# Altium schematic sheet conn_ext-module.SchDoc: Conectroes para Módulos Externos
size A4; Engineer: Amós Nunes; SheetNumber: 5; SheetTotal: 5; Tamanho: A4; Equipament: E. T. Wheelchair
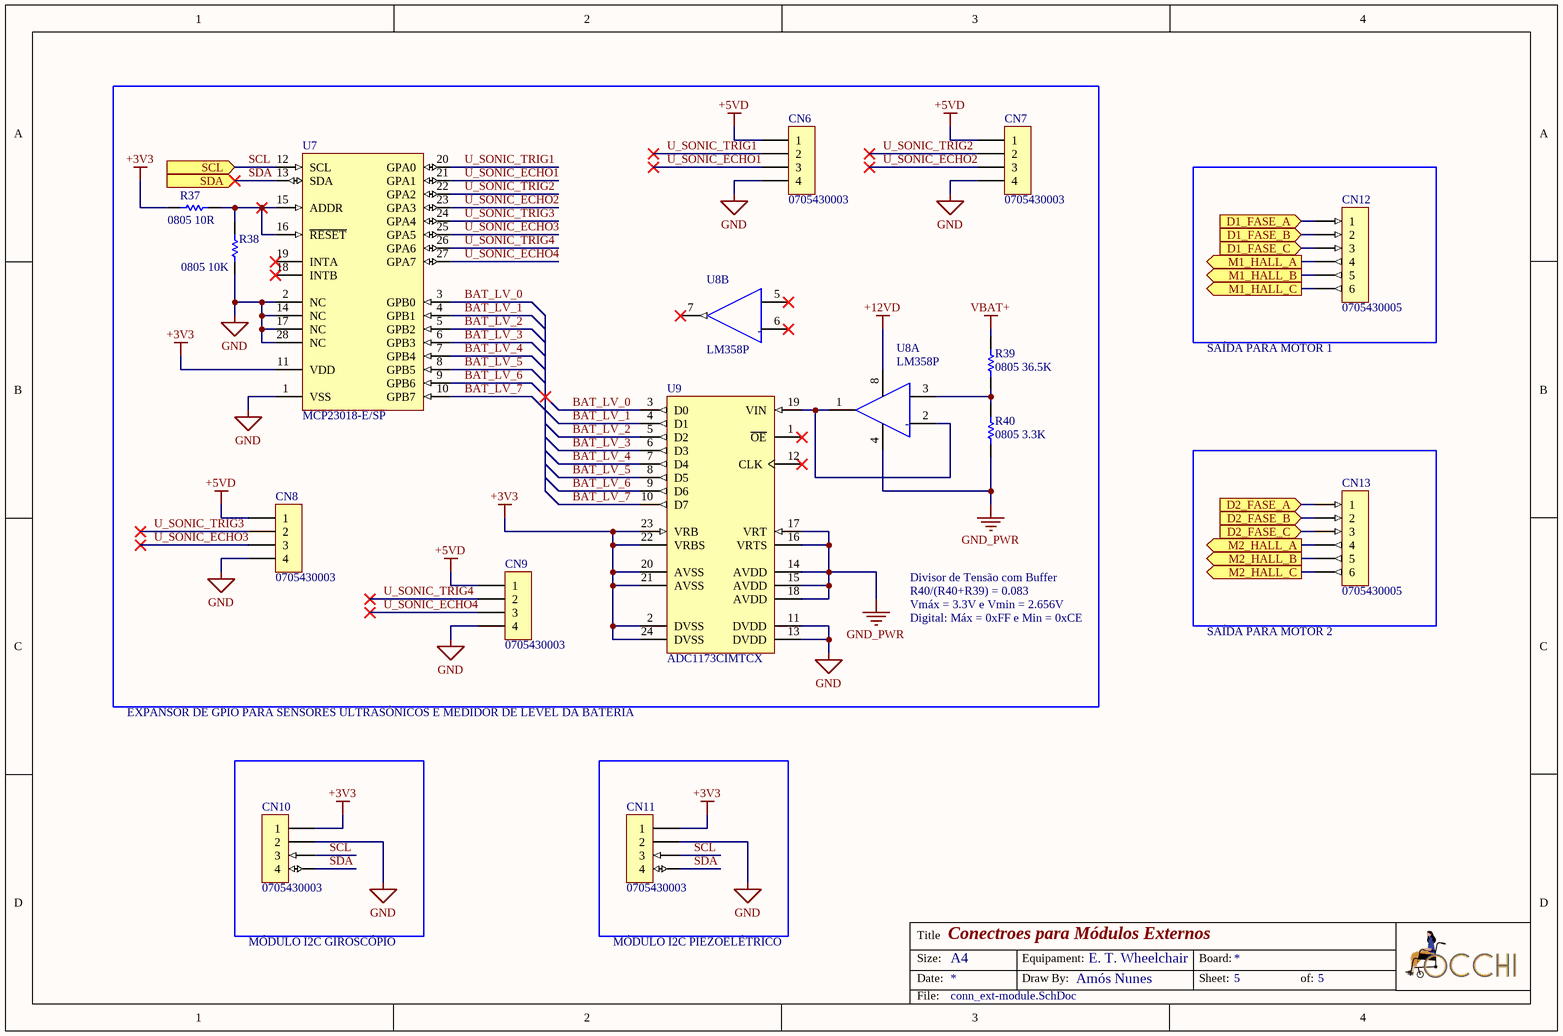
[diagram p0: conn_ext-module.SchDoc]

## Parts
CN6  0705430003  [FP-0705430003-MFG]
CN7  0705430003  [FP-0705430003-MFG]
CN8  0705430003  [FP-0705430003-MFG]
CN9  0705430003  [FP-0705430003-MFG]
CN10  0705430003  [FP-0705430003-MFG]
CN11  0705430003  [FP-0705430003-MFG]
CN12  0705430005  [FP-0705430005-MFG]
CN13  0705430005  [FP-0705430005-MFG]
R37  0805 10R  [CAP0805]
R38  0805 10K  [RES0805]
R39  0805 36.5K  [RES0805]
R40  0805 3.3K  [RES0805]
U7  MCP23018-E/SP  [SPDIP300-SP28]
U8  LM358P  [P0008A]  (parts A,B of 2)
U9  ADC1173CIMTCX  [PW0024A_N]

## Ports
D1_FASE_A (in), D1_FASE_B (in), D1_FASE_C (in), D2_FASE_A (in), D2_FASE_B (in), D2_FASE_C (in), M1_HALL_A (out), M1_HALL_B (out), M1_HALL_C (out), M2_HALL_A (out), M2_HALL_B (out), M2_HALL_C (out), SCL (in), SDA (in)

## Nets
+3V3: CN10.1 CN11.1 R37.1 U7.11(VDD) U9.2(DVSS) U9.20(AVSS) U9.21(AVSS) U9.22(VRBS) U9.23(VRB) U9.24(DVSS)
+5VD: CN6.1 CN7.1 CN8.1 CN9.1
+12VD: U8.8(V+)
GND: CN6.4 CN7.4 CN8.4 CN9.4 CN10.2 CN11.2 R38.2 U7.1(VSS) U7.2(NC) U7.14(NC) U7.17(NC) U7.28(NC) U9.11(DVDD) U9.13(DVDD)
GND_PWR: R40.1 U8.4(V-) U9.14(AVDD) U9.15(AVDD) U9.16(VRTS) U9.17(VRT) U9.18(AVDD)
VBAT+: R39.2
BAT_LV_0: U7.3(GPB0) U9.3(D0)
BAT_LV_1: U7.4(GPB1) U9.4(D1)
BAT_LV_2: U7.5(GPB2) U9.5(D2)
BAT_LV_3: U7.6(GPB3) U9.6(D3)
BAT_LV_4: U7.7(GPB4) U9.7(D4)
BAT_LV_5: U7.8(GPB5) U9.8(D5)
BAT_LV_6: U7.9(GPB6) U9.9(D6)
BAT_LV_7: U7.10(GPB7) U9.10(D7)
D1_FASE_A: CN12.1 ; port D1_FASE_A
D1_FASE_B: CN12.2 ; port D1_FASE_B
D1_FASE_C: CN12.3 ; port D1_FASE_C
D2_FASE_A: CN13.1 ; port D2_FASE_A
D2_FASE_B: CN13.2 ; port D2_FASE_B
D2_FASE_C: CN13.3 ; port D2_FASE_C
M1_HALL_A: CN12.4 ; port M1_HALL_A
M1_HALL_B: CN12.5 ; port M1_HALL_B
M1_HALL_C: CN12.6 ; port M1_HALL_C
M2_HALL_A: CN13.4 ; port M2_HALL_A
M2_HALL_B: CN13.5 ; port M2_HALL_B
M2_HALL_C: CN13.6 ; port M2_HALL_C
SCL: CN10.3 CN11.3 U7.12(SCL) ; port SCL
SDA: CN10.4 CN11.4 U7.13(SDA) ; port SDA
U_SONIC_ECHO1: CN6.3 U7.21(GPA1)
U_SONIC_ECHO2: CN7.3 U7.23(GPA3)
U_SONIC_ECHO3: CN8.3 U7.25(GPA5)
U_SONIC_ECHO4: CN9.3 U7.27(GPA7)
U_SONIC_TRIG1: CN6.2 U7.20(GPA0)
U_SONIC_TRIG2: CN7.2 U7.22(GPA2)
U_SONIC_TRIG3: CN8.2 U7.24(GPA4)
U_SONIC_TRIG4: CN9.2 U7.26(GPA6)
NetR37_2: R37.2 R38.1 U7.15(ADDR) U7.16(~{RESET})
NetR39_1: R39.1 R40.2 U8.3(IN1+)
NetU8_1: U8.1(1OUT) U8.2(IN1-) U9.19(VIN)

Not connected (* = marked no-connect by the designer): U7 18(INTB)* 19(INTA)*; U8 5(IN2+)* 6(IN2-)* 7(2OUT)*; U9 1(~{OE})* 12(CLK)*

## Notes on the sheet
- SAÍDA PARA MOTOR 1
- Divisor de Tensão com Buffer
- R40/(R40+R39) = 0.083
- Vmáx = 3.3V e Vmin = 2.656V
- Digital: Máx = 0xFF e Min = 0xCE
- SAÍDA PARA MOTOR 2
- EXPANSOR DE GPIO PARA SENSORES ULTRASÔNICOS E MEDIDOR DE LEVEL DA BATERIA
- MÓDULO I2C GIROSCÓPIO
- MÓDULO I2C PIEZOELÉTRICO
- Title
- Size:
- Date:
- Equipament:
- Draw By:
- Sheet:
- Board:
- of:
- File:
- (in symbol LM358P, part A) -
- (in symbol LM358P, part B) -

## Library data of the parts
CN6-CN11 = 0705430003: 2.54mm SL Header, Single Row, Vertical, 3.05mm Pocket, Shrouded, 4 Circuits, 0.38µm Gold (Au) Selective Plating, Tin (Sn) PC Tail Plating; Manufacturer: Molex; Contact Resistance: 30mR; Number of Positions: 4; Connector Type: Male Pin; Pitch: 0.1inch; Supplier 1: RSComponents; Manufacturer Part Number: 0705430003; RoHS: Yes; Category: Headers and Wire Housings; Stock 1: 2910; Pricing 1: 10=1,05000, 200=0,90600, 750=0,74800, 3000=0,60400, 6000=0,57300 (USD); Mount: Through Hole; Color: Black; Contact Plating: Gold; Contact Material: Bronze; Housing Color: Black; Housing Material: Polyester; Min Operating Temperature: -40°C; Max Operating Temperature: 105°C; Packaging: Rail/Tube; Number of Rows: 1; Termination: Solder; Orientation: Straight; Series: C-Grid® SL™ 70543; Contact Type: Male Pin; Length: 12.71mm; Depth: 6.6mm; Contact Mating Length: 0.24inch; Radiation Hardening: No; RoHS Compliant: Yes; Supplier Part Number 1: 6792471
CN12 CN13 = 0705430005: Conn Shrouded Header (4 Sides) HDR 6 POS 2.54mm Solder ST Top Entry Thru-Hole SL™ Tube; Manufacturer: Molex; Contact Resistance: 30mR; Number of Positions: 6; Connector Type: Male Pin; Pitch: 0.1inch; Supplier 1: RSComponents; Manufacturer Part Number: 0705430005; RoHS: Yes; Category: Headers and Wire Housings; Stock 1: 440; Pricing 1: 10=1,32100, 200=1,15000, 750=0,92500, 3000=0,75400, 6000=0,73000 (USD); Mount: Through Hole; Contact Plating: Gold; Contact Material: Bronze; Color: Black; Housing Color: Black; Housing Material: Polyester; Min Operating Temperature: -40°C; Max Operating Temperature: 105°C; Packaging: Rail/Tube; Number of Rows: 1; Termination: Solder; Orientation: Straight; Series: C-Grid® SL™ 70543; Contact Type: Male Pin; Length: 17.79mm; Depth: 6.6mm; Contact Mating Length: 0.24inch; Radiation Hardening: No; RoHS Compliant: Yes; ComponentLink1URL: http://components.arrow.com/part/dataview/2934603S3153303N3303?src-supplier=Arrow+Electronics; ComponentLink1Description: http://components.arrow.com/part/dataview/2934603S3153303N3303?src-supplier=Arrow+Electronics; ComponentLink2URL: http://components.arrow.com/part/dataview/0323_00048382?src-supplier=Arrow+Europe; ComponentLink2Description: http://components.arrow.com/part/dataview/0323_00048382?src-supplier=Arrow+Europe; Supplier Part Number 1: 6792483
R37 = RC0805FR-0710RL: 10R Ohms ± 1.00% 0.125W ± 200ppm/℃ 0805; Manufacturer: Yageo; Power Rating: 125mW; Tolerance: 1%; Voltage Rating: 150V; Temperature Coefficient: 200ppm/°C; Supplier 1: RSComponents; Manufacturer Part Number: RC0805FR-0710RL; RoHS: Yes; Category: Chip SMD Resistors; Stock 1: 170000; Pricing 1: 5000=0,01300 (USD); Case/Package: 0805; Number of Pins: 2; Case Code (Imperial): 0805; Case Code (Metric): 2012; Size Code: 0805; Min Operating Temperature: -55°C; Max Operating Temperature: 155°C; Resistance: 10R; Packaging: Tape and Reel; Voltage Rating (DC): 150V; Package Quantity: 1; Termination: SMD/SMT; Resistor Type: Thick Film; Number of Terminations: 2; Max Power Dissipation: 125mW; Features: Moisture Resistant; Series: RC; Resistance Tolerance: 1%; Construction: Rectangular; Technology: THICK FILM; Length: 2mm; Width: 1.25mm; Height: 0.5mm; Depth: 1.25mm; RoHS Compliant: Yes; REACH SVHC: No SVHC; Lead Free: Lead Free; ComponentLink1URL: https://datasheet.ciiva.com/11809/0900766b8106beab-11809370.pdf?src-supplier=RSComponents; ComponentLink1Description: https://datasheet.ciiva.com/11809/0900766b8106beab-11809370.pdf?src-supplier=RSComponents; ComponentLink2URL: https://datasheet.ciiva.com/46412/444164-46412859.pdf?src-supplier=Element14; ComponentLink2Description: https://datasheet.ciiva.com/46412/444164-46412859.pdf?src-supplier=Element14; ComponentLink3URL: https://datasheet.ciiva.com/46447/444164-46447565.pdf?src-supplier=Element14; ComponentLink3Description: https://datasheet.ciiva.com/46447/444164-46447565.pdf?src-supplier=Element14; ComponentLink4URL: https://datasheet.ciiva.com/2457/pyu-r-int-thick-7-2457099.pdf?src-supplier=Digi-Key; ComponentLink4Description: https://datasheet.ciiva.com/2457/pyu-r-int-thick-7-2457099.pdf?src-supplier=Digi-Key; ComponentLink5URL: https://datasheet.ciiva.com/2457/pyu-r-int-thick-7-2457100.pdf?src-supplier=Digi-Key; ComponentLink5Description: https://datasheet.ciiva.com/2457/pyu-r-int-thick-7-2457100.pdf?src-supplier=Digi-Key; ComponentLink6URL: https://datasheet.ciiva.com/2457/pyu-r-int-thick-7-2457098.pdf?src-supplier=Digi-Key; ComponentLink6Description: https://datasheet.ciiva.com/2457/pyu-r-int-thick-7-2457098.pdf?src-supplier=Digi-Key; ComponentLink7URL: https://datasheet.ciiva.com/12555/rc0805-257173-12555112.pdf?src-supplier=Mouser; ComponentLink7Description: https://datasheet.ciiva.com/12555/rc0805-257173-12555112.pdf?src-supplier=Mouser; ComponentLink8URL: https://datasheet.ciiva.com/7941/444164-7941688.pdf?src-supplier=Element14; ComponentLink8Description: https://datasheet.ciiva.com/7941/444164-7941688.pdf?src-supplier=Element14; ComponentLink9URL: https://datasheet.ciiva.com/7941/444164-7941687.pdf?src-supplier=Element14; ComponentLink9Description: https://datasheet.ciiva.com/7941/444164-7941687.pdf?src-supplier=Element14; Supplier Part Number 1: 6185179
R38 = RC0805FR-0710KL: 10K Omhs 0805 ± 1.00% 0.125W ± 100ppm/℃; Manufacturer: Yageo; Manufacturer Part Number: RC0603FR-0710KL; Tolerance: 1%; Resistance: 10kR; Temperature Coefficient: 100ppm/°C; Voltage Rating: 75V; Voltage Rating (DC): 50V; Power Rating: 100mW; RoHS: Yes; Category: Chip SMD Resistors; Stock 1: 19091268; Pricing 1: 5000=0,00312 (USD); Case/Package: 0603; Number of Pins: 2; Case Code (Imperial): 0603; Case Code (Metric): 1608; Weight: 7.1E-05oz; Size Code: 0603; Min Operating Temperature: -55°C; Max Operating Temperature: 155°C; Resistor Type: Thick Film; Packaging: Tape and Reel; Termination: SMD/SMT; Features: Moisture Resistant; Series: RC; Max Power Dissipation: 100mW; Number of Terminations: 2; Resistance Tolerance: 1%; Construction: Rectangular; Length: 1.6mm; Width: 0.8mm; Height: 0.45mm; Depth: 0.8mm; Lead Pitch: 0.3mm; RoHS Compliant: Yes; REACH SVHC: Unknown; Military Standard: Not; Lead Free: Lead Free; ComponentLink1URL: https://datasheet.ciiva.com/7660/38590-7660789.pdf?src-supplier=Element14; ComponentLink1Description: https://datasheet.ciiva.com/7660/38590-7660789.pdf?src-supplier=Element14; ComponentLink2URL: https://datasheet.ciiva.com/7983/443971-7983596.pdf?src-supplier=Element14; ComponentLink2Description: https://datasheet.ciiva.com/7983/443971-7983596.pdf?src-supplier=Element14; ComponentLink3URL: https://datasheet.ciiva.com/22747/443971-22747519.pdf?src-supplier=Element14; ComponentLink3Description: https://datasheet.ciiva.com/22747/443971-22747519.pdf?src-supplier=Element14; ComponentLink4URL: https://datasheet.ciiva.com/46440/1868787-46440891.pdf?src-supplier=Element14; ComponentLink4Description: https://datasheet.ciiva.com/46440/1868787-46440891.pdf?src-supplier=Element14; ComponentLink5URL: https://datasheet.ciiva.com/7746/1738695-7746239.pdf?src-supplier=Element14; ComponentLink5Description: https://datasheet.ciiva.com/7746/1738695-7746239.pdf?src-supplier=Element14; ComponentLink6URL: https://datasheet.ciiva.com/15189/getdatasheetpartid-409289-15189591.pdf?src-supplier=Verical; ComponentLink6Description: https://datasheet.ciiva.com/15189/getdatasheetpartid-409289-15189591.pdf?src-supplier=Verical; Stock 2: 435000; Pricing 2: 5000=0,00700 (USD); Package Quantity: 1; Technology: THICK FILM; ComponentLink7URL: https://datasheet.ciiva.com/11808/0900766b8106beab-11808151.pdf?src-supplier=RSComponents; ComponentLink7Description: https://datasheet.ciiva.com/11808/0900766b8106beab-11808151.pdf?src-supplier=RSComponents; ComponentLink8URL: https://datasheet.ciiva.com/46447/444164-46447563.pdf?src-supplier=Element14; ComponentLink8Description: https://datasheet.ciiva.com/46447/444164-46447563.pdf?src-supplier=Element14; ComponentLink9URL: https://datasheet.ciiva.com/2456/pyu-r-int-thick-7-2456973.pdf?src-supplier=Digi-Key; ComponentLink9Description: https://datasheet.ciiva.com/2456/pyu-r-int-thick-7-2456973.pdf?src-supplier=Digi-Key; ComponentLink10URL: https://datasheet.ciiva.com/2456/pyu-r-int-thick-7-2456974.pdf?src-supplier=Digi-Key; ComponentLink10Description: https://datasheet.ciiva.com/2456/pyu-r-int-thick-7-2456974.pdf?src-supplier=Digi-Key; ComponentLink11URL: https://datasheet.ciiva.com/2456/pyu-r-int-thick-7-2456972.pdf?src-supplier=Digi-Key; ComponentLink11Description: https://datasheet.ciiva.com/2456/pyu-r-int-thick-7-2456972.pdf?src-supplier=Digi-Key; ComponentLink12URL: https://datasheet.ciiva.com/12669/rc0805-12669688.pdf?src-supplier=Mouser; ComponentLink12Description: https://datasheet.ciiva.com/12669/rc0805-12669688.pdf?src-supplier=Mouser; ComponentLink13URL: https://datasheet.ciiva.com/16747/rc0805-16747087.pdf?src-supplier=Future+Electronics; ComponentLink13Description: https://datasheet.ciiva.com/16747/rc0805-16747087.pdf?src-supplier=Future+Electronics; Supplier 1: RSComponents; Supplier Part Number 1: 6185163
R39 = RT0805DRE0736K5L: High Precision-High Stability Chip Resistor Thin Film 0805 36.5kOhm 0.5% Paper T/R; Manufacturer: Yageo; Resistance: 36.5kR; Max Power Dissipation: 125mW; Temperature Coefficient: 50ppm/°C; Voltage Rating (DC): 150V; Supplier 1: Digi-Key; Manufacturer Part Number: RT0805DRE0736K5L; RoHS: Yes; Category: Chip SMD Resistors; Stock 1: 9420; Pricing 1: 1=0,13000, 10=0,11500, 100=0,04430, 1000=0,01947, 2500=0,01682 (USD); Case/Package: 0805; Case Code (Metric): 2012; Case Code (Imperial): 0805; Min Operating Temperature: -55°C; Max Operating Temperature: 155°C; Package Quantity: 5000; Packaging: Tape and Reel; Tolerance: 0.5%; Resistor Type: Thin Film; Number of Terminations: 2; Features: Moisture Resistant; Series: RT; Length: 0.079inch; Width: 0.049inch; Height: 0.024inch; Lead Free: Lead Free; RoHS Compliant: Yes; ComponentLink1URL: https://datasheet.ciiva.com/2569/pyu-rt-1-to-0-05-rohs-l-5-2569442.pdf?src-supplier=Digi-Key; ComponentLink1Description: https://datasheet.ciiva.com/2569/pyu-rt-1-to-0-05-rohs-l-5-2569442.pdf?src-supplier=Digi-Key; Supplier Part Number 1: 311-2852-1-ND
R40 = RC0805FR-073K3L: Res Thick Film 0805 3.3K Ohm 1% 0.125W(1/8W) ±100ppm/C Epoxy Pad SMD T/R; Manufacturer: Yageo; Resistance: 3.3kR; Temperature Coefficient: 100ppm/°C; Power Rating: 125mW; Voltage Rating: 150V; Supplier 1: RSComponents; Manufacturer Part Number: RC0805FR-073K3L; RoHS: Yes; Category: Chip SMD Resistors; Stock 1: 4400; Pricing 1: 5000=0,00400, 25000=0,00400, 50000=0,00400, 100000=0,00300, 200000=0,00300 (GBP); Case/Package: 0805; Case Code (Metric): 2012; Case Code (Imperial): 0805; Weight: 0.000194oz; Size Code: 0805; Min Operating Temperature: -55°C; Max Operating Temperature: 155°C; Tolerance: 1%; Packaging: Tape and Reel; Resistor Type: Thick Film; Package Quantity: 1; Number of Terminations: 2; Termination: SMD/SMT; Max Power Dissipation: 125mW; Features: Moisture Resistant; Series: RC; Resistance Tolerance: 1%; Length: 0.079inch; Width: 0.049inch; Height: 0.024inch; Depth: 1.25mm; REACH SVHC: No SVHC; Lead Free: Lead Free; RoHS Compliant: Yes; ComponentLink1URL: https://datasheet.ciiva.com/46447/444164-46447579.pdf?src-supplier=Element14; ComponentLink1Description: https://datasheet.ciiva.com/46447/444164-46447579.pdf?src-supplier=Element14; ComponentLink2URL: https://datasheet.ciiva.com/2457/pyu-r-int-thick-7-2457993.pdf?src-supplier=Digi-Key; ComponentLink2Description: https://datasheet.ciiva.com/2457/pyu-r-int-thick-7-2457993.pdf?src-supplier=Digi-Key; ComponentLink3URL: https://datasheet.ciiva.com/2457/pyu-r-int-thick-7-2457994.pdf?src-supplier=Digi-Key; ComponentLink3Description: https://datasheet.ciiva.com/2457/pyu-r-int-thick-7-2457994.pdf?src-supplier=Digi-Key; ComponentLink4URL: https://datasheet.ciiva.com/2457/pyu-r-int-thick-7-2457992.pdf?src-supplier=Digi-Key; ComponentLink4Description: https://datasheet.ciiva.com/2457/pyu-r-int-thick-7-2457992.pdf?src-supplier=Digi-Key; ComponentLink5URL: https://datasheet.ciiva.com/12577/rc0805-12577341.pdf?src-supplier=Mouser; ComponentLink5Description: https://datasheet.ciiva.com/12577/rc0805-12577341.pdf?src-supplier=Mouser; ComponentLink6URL: https://datasheet.ciiva.com/7941/444164-7941782.pdf?src-supplier=Element14; ComponentLink6Description: https://datasheet.ciiva.com/7941/444164-7941782.pdf?src-supplier=Element14; ComponentLink7URL: https://datasheet.ciiva.com/7941/444164-7941783.pdf?src-supplier=Element14; ComponentLink7Description: https://datasheet.ciiva.com/7941/444164-7941783.pdf?src-supplier=Element14; ComponentLink8URL: https://datasheet.ciiva.com/16747/rc0805-16747115.pdf?src-supplier=Future+Electronics; ComponentLink8Description: https://datasheet.ciiva.com/16747/rc0805-16747115.pdf?src-supplier=Future+Electronics; Supplier Part Number 1: 1995715
U7 = MCP23018-E/SP: I2C Interface 3400kHz 5.5V Automotive 28-Pin SPDIP Tube; Manufacturer: Microchip; Output Current: 25mA; Min Supply Voltage: 1.8V; Interface: I2C,Serial; Number of I/Os: 16; Frequency: 3.4MHz; Number of Channels: 1; Nominal Supply Current: 1mA; Power Dissipation: 700mW; Supplier 1: RSComponents; Manufacturer Part Number: MCP23018-E/SP; RoHS: Yes; Category: Interface ICs; Stock 1: 25; Pricing 1: 5=2,06300, 25=1,99900, 100=1,92900 (USD); Mount: Through Hole; Case/Package: DIP; Number of Pins: 28; Min Operating Temperature: -40°C; Max Operating Temperature: 125°C; Packaging: Rail/Tube; Max Supply Voltage: 5.5V; Max Frequency: 3.4MHz; Package Quantity: 15; Supply Voltage-Nom: 5.5V; Supply Current: 1mA; REACH SVHC: No SVHC; RoHS Compliant: Yes; Lead Free: Lead Free; ComponentLink1URL: https://datasheet.ciiva.com/1780/22103a-1780576.pdf?src-supplier=Digi-Key; ComponentLink1Description: https://datasheet.ciiva.com/1780/22103a-1780576.pdf?src-supplier=Digi-Key; ComponentLink2URL: https://datasheet.ciiva.com/41459/001086040-da-01-en-ic-i-o-exp-i2-mcp23018-e-sp-sdip-28-mcp-41459414.pdf?src-supplier=Conrad; ComponentLink2Description: https://datasheet.ciiva.com/41459/001086040-da-01-en-ic-i-o-exp-i2-mcp23018-e-sp-sdip-28-mcp-41459414.pdf?src-supplier=Conrad; ComponentLink3URL: https://datasheet.ciiva.com/1496/673896-1496063.pdf?src-supplier=Element14; ComponentLink3Description: https://datasheet.ciiva.com/1496/673896-1496063.pdf?src-supplier=Element14; ComponentLink4URL: https://datasheet.ciiva.com/12266/22103a-12266808.pdf?src-supplier=Mouser; ComponentLink4Description: https://datasheet.ciiva.com/12266/22103a-12266808.pdf?src-supplier=Mouser; ComponentLink5URL: https://datasheet.ciiva.com/3149/22103a-3149163.pdf?src-supplier=Avnet; ComponentLink5Description: https://datasheet.ciiva.com/3149/22103a-3149163.pdf?src-supplier=Avnet; Supplier Part Number 1: 6696455
U8 = LM358P: 8-Bit 15MSPS Analog-to-Digital Converter (ADC) 24-TSSOP -40 to 75; Manufacturer: Texas Instruments; Manufacturer Part Number: LM358DR; Output Current: 30mA; Min Dual Supply Voltage: 1.5V; Input Offset Voltage (Vos): 7mV; Power Supply Rejection Ratio (PSRR): 65dB; Unity Gain Bandwidth Product: 700kHz; Number of Channels: 2; Min Supply Voltage: 3V; Max Dual Supply Voltage: 16V; Dual Supply Voltage: 9V; Max Supply Voltage: 32V; Nominal Supply Current: 1.2mA; Slew Rate: 0.3V/µs; Input Bias Current: 250nA; Voltage Gain: 100dB; Operating Supply Current: 1mA; Max Supply Current: 700uA; Interface: SPI,Serial,Parallel; Max Power Dissipation: 10mW; Number of Bits: 10; Sampling Rate: 15MS/s; Number of Converters: 1; Resolution: 8b; Polarity: Unipolar; Power Dissipation: 36mW; Supply Type: Single,Analog,Digital; Conversion Rate: 15000KS/s; Integral Nonlinearity (INL): 1.3LSB; Signal to Noise Ratio (SNR): 49dB; Power Consumption: 33mW; Differential Nonlinearity: 0.85LSB; REACH SVHC: No SVHC; Package Quantity: 2500; Width: 3.91mm; Max Operating Temperature: 70°C; Min Operating Temperature: 0°C; Mount: Surface Mount; Length: 4.9mm; Radiation Hardening: No; Case/Package: SOIC; Lead Free: Lead Free; Number of Elements: 2; Packaging: Tape and Reel; Output Current per Channel: 30mA; Number of Circuits: 2; Bandwidth: 700kHz; Operating Supply Voltage: 16V; Gain Bandwidth Product: 700kHz; Number of Pins: 8; Number of Amplifiers: 2; Height: 1.58mm; Common Mode Rejection Ratio: 65dB; Contact Plating: Gold; RoHS: Yes; Category: Amplifiers - Op Amps, Buffer, Instrumentation; Stock 1: 85; Pricing 1: 1=0,39000, 10=0,31400, 25=0,28720, 100=0,21370, 250=0,19368, 500=0,16028, 1000=0,12020 (USD); ComponentLink1URL: https://datasheet.ciiva.com/1795/lm358-1795488.pdf?src-supplier=Digi-Key; ComponentLink1Description: https://datasheet.ciiva.com/1795/lm358-1795488.pdf?src-supplier=Digi-Key; ComponentLink2URL: https://datasheet.ciiva.com/27056/2016330-27056228.pdf?src-supplier=Jameco; ComponentLink2Description: https://datasheet.ciiva.com/27056/2016330-27056228.pdf?src-supplier=Jameco; ComponentLink3URL: https://datasheet.ciiva.com/26847/lm358dr-26847142.pdf?src-supplier=IIIC; ComponentLink3Description: https://datasheet.ciiva.com/26847/lm358dr-26847142.pdf?src-supplier=IIIC; ComponentLink4URL: https://datasheet.ciiva.com/7709/1874566-7709823.pdf?src-supplier=Element14; ComponentLink4Description: https://datasheet.ciiva.com/7709/1874566-7709823.pdf?src-supplier=Element14; ComponentLink5URL: https://datasheet.ciiva.com/46385/1874566-46385851.pdf?src-supplier=Element14; ComponentLink5Description: https://datasheet.ciiva.com/46385/1874566-46385851.pdf?src-supplier=Element14; ComponentLink6URL: https://datasheet.ciiva.com/46390/1874566-46390414.pdf?src-supplier=Element14; ComponentLink6Description: https://datasheet.ciiva.com/46390/1874566-46390414.pdf?src-supplier=Element14; ComponentLink7URL: https://datasheet.ciiva.com/1795/lm358-1795487.pdf?src-supplier=Digi-Key; ComponentLink7Description: https://datasheet.ciiva.com/1795/lm358-1795487.pdf?src-supplier=Digi-Key; ComponentLink8URL: https://datasheet.ciiva.com/1795/lm358-1795489.pdf?src-supplier=Digi-Key; ComponentLink8Description: https://datasheet.ciiva.com/1795/lm358-1795489.pdf?src-supplier=Digi-Key; ComponentLink9URL: https://datasheet.ciiva.com/2973/lm358a-2973386.pdf?src-supplier=Avnet; ComponentLink9Description: https://datasheet.ciiva.com/2973/lm358a-2973386.pdf?src-supplier=Avnet; Stock 2: 6762; Pricing 2: 1=3,94000, 10=3,54200, 25=3,34840, 100=2,90210, 250=2,75324, 500=2,47048, 1000=2,45700 (USD); RoHS Compliant: Yes; ComponentLink10URL: https://datasheet.ciiva.com/19481/826793-19481572.pdf?src-supplier=Jameco; ComponentLink10Description: https://datasheet.ciiva.com/19481/826793-19481572.pdf?src-supplier=Jameco; ComponentLink11URL: https://datasheet.ciiva.com/1796/lm358-1796537.pdf?src-supplier=Digi-Key; ComponentLink11Description: https://datasheet.ciiva.com/1796/lm358-1796537.pdf?src-supplier=Digi-Key; ComponentLink12URL: https://datasheet.ciiva.com/2973/lm358a-2973400.pdf?src-supplier=Avnet; ComponentLink12Description: https://datasheet.ciiva.com/2973/lm358a-2973400.pdf?src-supplier=Avnet; ComponentLink13URL: https://datasheet.ciiva.com/26244/lm358a-26244121.pdf?src-supplier=Avnet+Europe; ComponentLink13Description: https://datasheet.ciiva.com/26244/lm358a-26244121.pdf?src-supplier=Avnet+Europe; Number of A/D Converters: 1; Number of Analog Inputs: 1; Series: PowerWise®; ComponentLink14URL: https://datasheet.ciiva.com/15147/getdatasheetpartid-55721-15147304.pdf?src-supplier=Verical; ComponentLink14Description: https://datasheet.ciiva.com/15147/getdatasheetpartid-55721-15147304.pdf?src-supplier=Verical; ComponentLink15URL: https://datasheet.ciiva.com/41460/001186649-da-01-en-ic-adc-8-adc1173cimtcx-nopb-tssop-24-tid-41460921.pdf?src-supplier=Conrad; ComponentLink15Description: https://datasheet.ciiva.com/41460/001186649-da-01-en-ic-adc-8-adc1173cimtcx-nopb-tssop-24-tid-41460921.pdf?src-supplier=Conrad; ComponentLink16URL: https://datasheet.ciiva.com/6664/adc1173-6664523.pdf?src-supplier=Digi-Key; ComponentLink16Description: https://datasheet.ciiva.com/6664/adc1173-6664523.pdf?src-supplier=Digi-Key; ComponentLink17URL: https://datasheet.ciiva.com/6664/adc1173-6664522.pdf?src-supplier=Digi-Key; ComponentLink17Description: https://datasheet.ciiva.com/6664/adc1173-6664522.pdf?src-supplier=Digi-Key; ComponentLink18URL: https://datasheet.ciiva.com/6664/adc1173-6664524.pdf?src-supplier=Digi-Key; ComponentLink18Description: https://datasheet.ciiva.com/6664/adc1173-6664524.pdf?src-supplier=Digi-Key; ComponentLink19URL: https://datasheet.ciiva.com/3037/adc1173-3037884.pdf?src-supplier=Avnet; ComponentLink19Description: https://datasheet.ciiva.com/3037/adc1173-3037884.pdf?src-supplier=Avnet; Supplier 1: Digi-Key; Supplier Part Number 1: 296-1395-5-ND
U9 = ADC1173CIMTCX/NOPB: 8-Bit 15MSPS Analog-to-Digital Converter (ADC) 24-TSSOP -40 to 75; Manufacturer: TI National Semiconductor; Operating Supply Voltage: 3V; Min Supply Voltage: 2.7V; Max Supply Voltage: 3.6V; Interface: SPI,Serial,Parallel; Max Power Dissipation: 10mW; Number of Channels: 1; Number of Bits: 10; Sampling Rate: 15MS/s; Resolution: 8b; Polarity: Unipolar; Power Dissipation: 36mW; Supply Type: Single,Analog,Digital; Conversion Rate: 15000KS/s; Integral Nonlinearity (INL): 1.3LSB; Signal to Noise Ratio (SNR): 49dB; Power Consumption: 33mW; Differential Nonlinearity: 0.85LSB; Supplier 1: Digi-Key; Manufacturer Part Number: ADC1173CIMTCX/NOPB; RoHS: Yes; Category: Analog to Digital Converters (ADCs); Stock 1: 6762; Pricing 1: 1=3,94000, 10=3,54200, 25=3,34840, 100=2,90210, 250=2,75324, 500=2,47048, 1000=2,45700 (USD); Mount: Surface Mount; Case/Package: TSSOP; Number of Pins: 24; Contact Plating: Tin; Min Operating Temperature: -40°C; Max Operating Temperature: 75°C; Packaging: Tape and Reel; Package Quantity: 2500; Number of Converters: 1; Number of Elements: 1; Number of A/D Converters: 1; Number of Analog Inputs: 1; Series: PowerWise®; Radiation Hardening: No; Lead Free: Lead Free; RoHS Compliant: Yes; ComponentLink1URL: https://datasheet.ciiva.com/15147/getdatasheetpartid-55721-15147304.pdf?src-supplier=Verical; ComponentLink1Description: https://datasheet.ciiva.com/15147/getdatasheetpartid-55721-15147304.pdf?src-supplier=Verical; ComponentLink2URL: https://datasheet.ciiva.com/41460/001186649-da-01-en-ic-adc-8-adc1173cimtcx-nopb-tssop-24-tid-41460921.pdf?src-supplier=Conrad; ComponentLink2Description: https://datasheet.ciiva.com/41460/001186649-da-01-en-ic-adc-8-adc1173cimtcx-nopb-tssop-24-tid-41460921.pdf?src-supplier=Conrad; ComponentLink3URL: https://datasheet.ciiva.com/6664/adc1173-6664523.pdf?src-supplier=Digi-Key; ComponentLink3Description: https://datasheet.ciiva.com/6664/adc1173-6664523.pdf?src-supplier=Digi-Key; ComponentLink4URL: https://datasheet.ciiva.com/6664/adc1173-6664522.pdf?src-supplier=Digi-Key; ComponentLink4Description: https://datasheet.ciiva.com/6664/adc1173-6664522.pdf?src-supplier=Digi-Key; ComponentLink5URL: https://datasheet.ciiva.com/6664/adc1173-6664524.pdf?src-supplier=Digi-Key; ComponentLink5Description: https://datasheet.ciiva.com/6664/adc1173-6664524.pdf?src-supplier=Digi-Key; ComponentLink6URL: https://datasheet.ciiva.com/3037/adc1173-3037884.pdf?src-supplier=Avnet; ComponentLink6Description: https://datasheet.ciiva.com/3037/adc1173-3037884.pdf?src-supplier=Avnet; Supplier Part Number 1: 296-35234-1-ND